# EasyEDA schematic Schematic.json
TITLE: New Schematic; REV: 1.0; Date: 2018-01-26; Sheet: 1/1; Drawn By: ridvanaltun
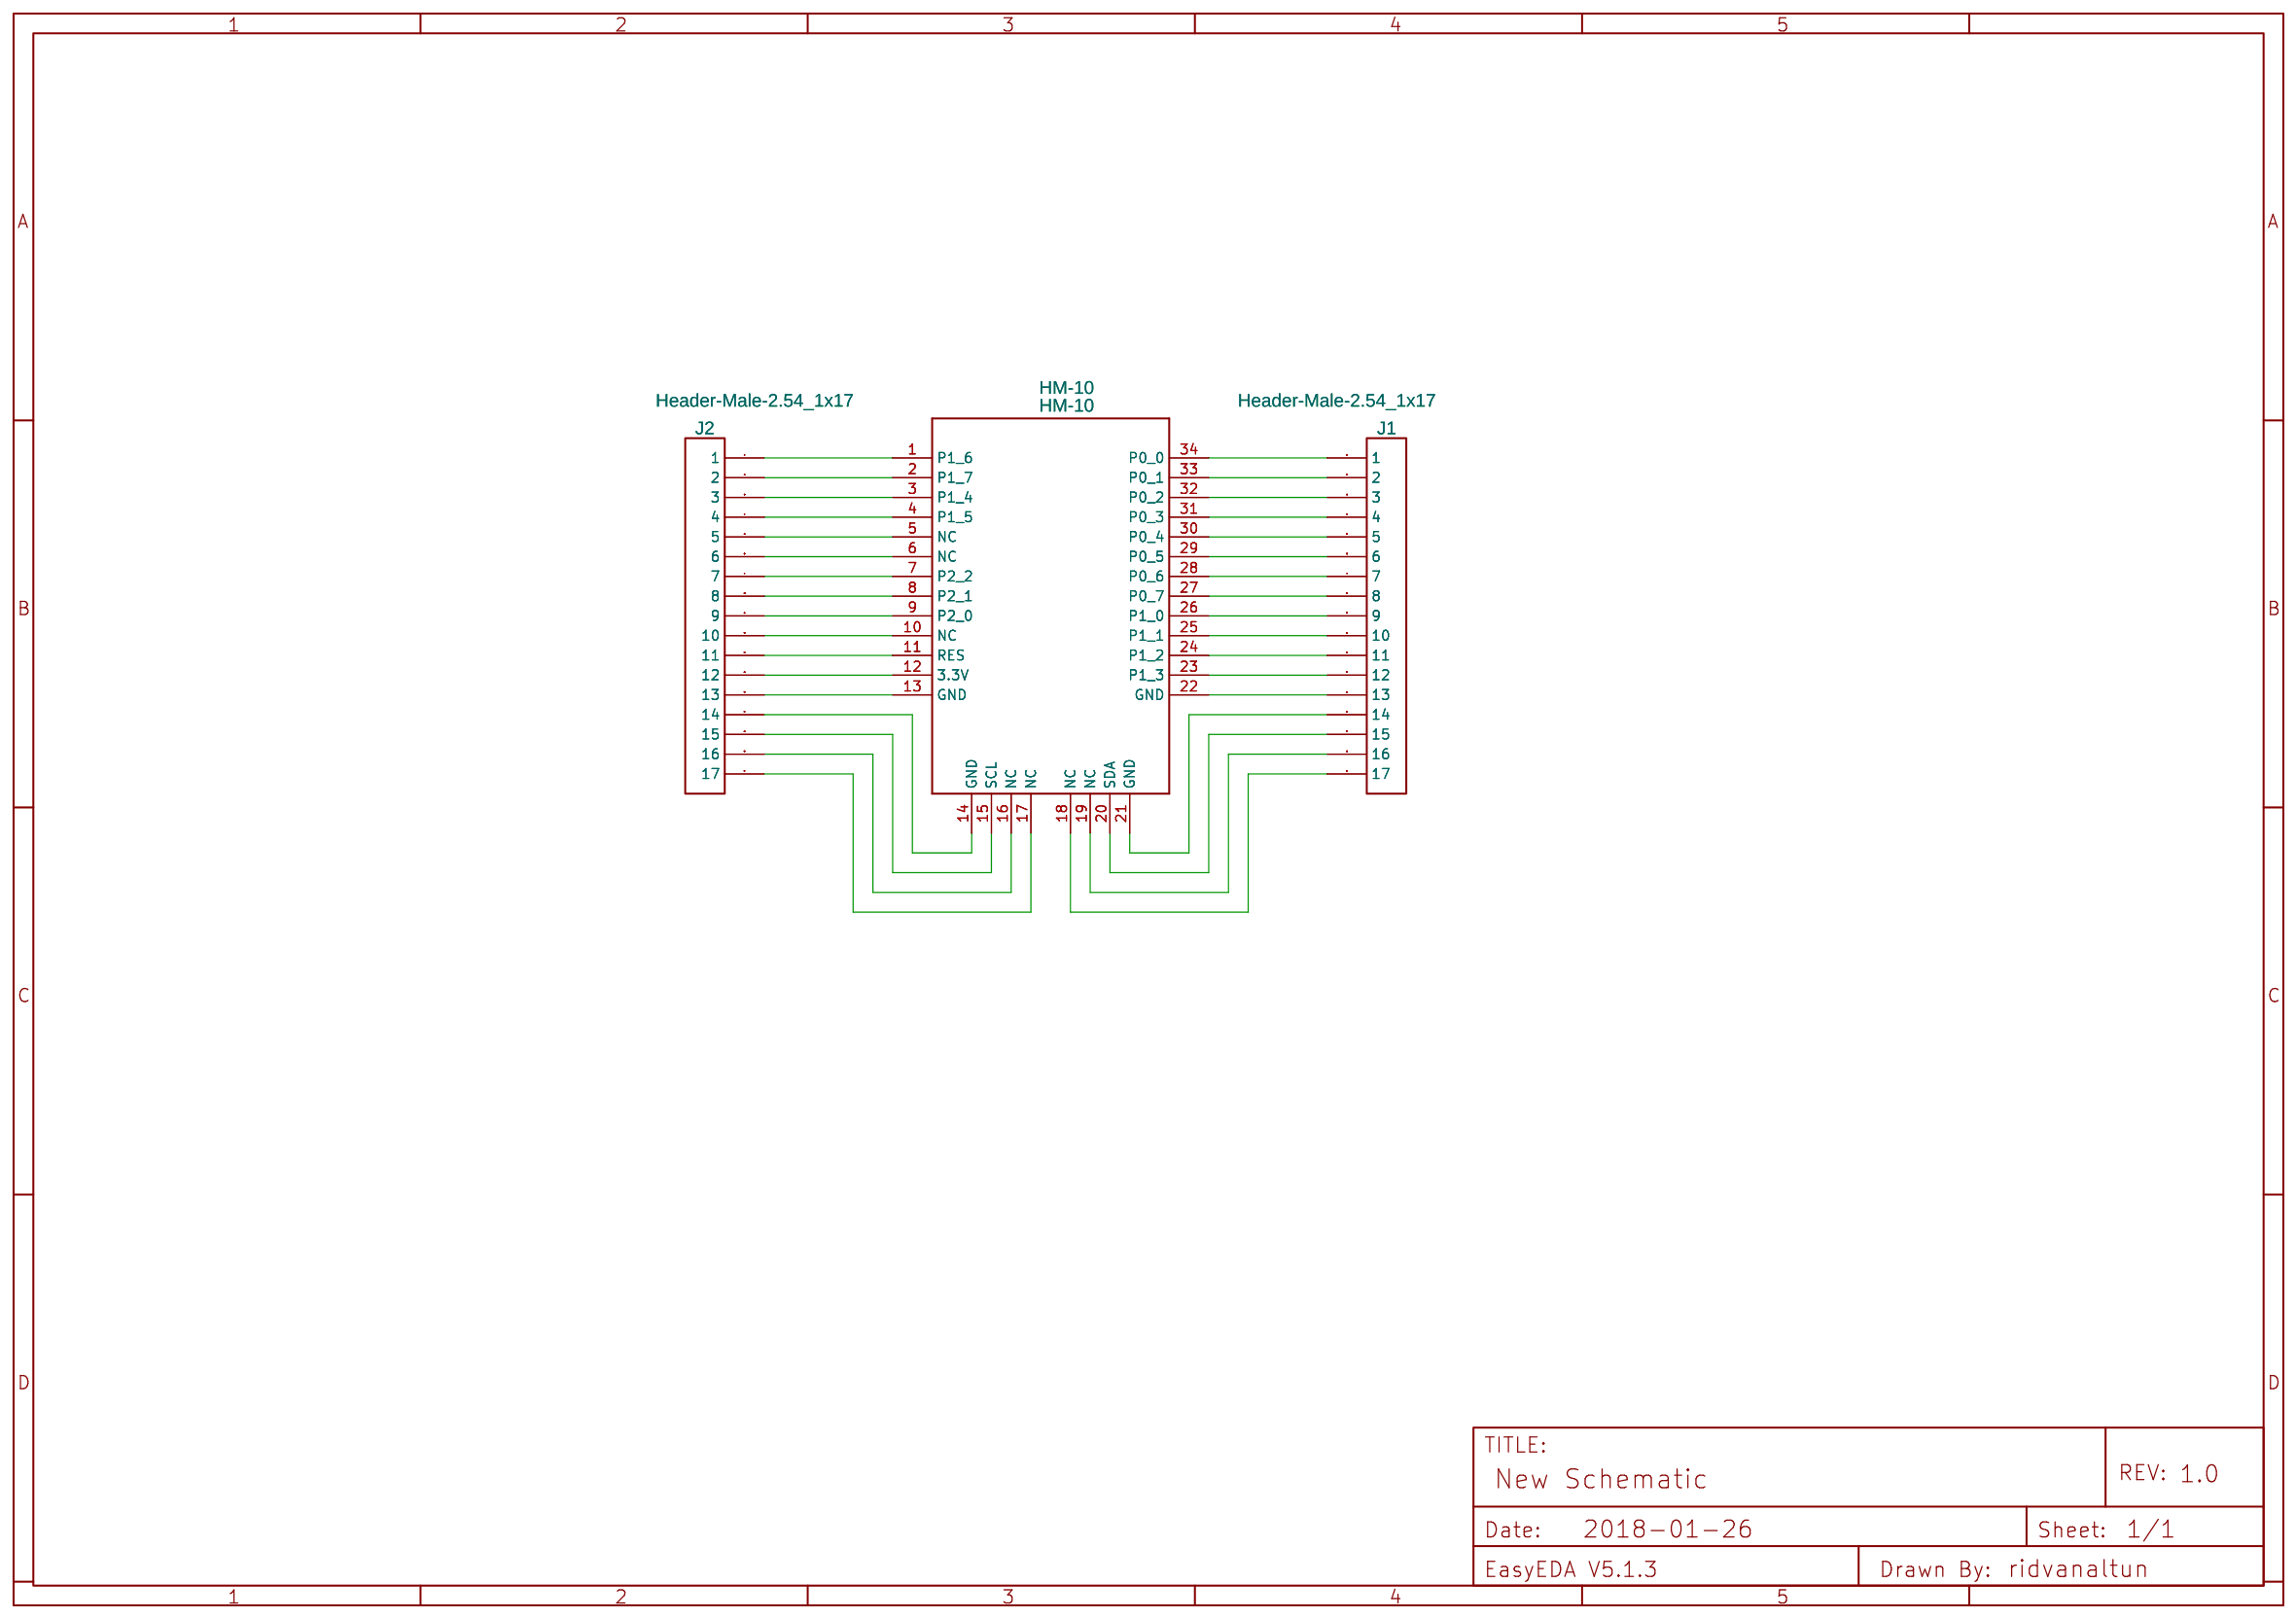
[diagram p0: schematic sheet]

## Parts
HM-10  HM-10  [HM-10]
J1  Header-Male-2.54_1x17  [17X1/2.54 PIN HEADER]
J2  Header-Male-2.54_1x17  [17X1/2.54 PIN HEADER]

## Library data of the parts
HM-10 = -: Manufacturer Part: ?
J1 J2 = -: Manufacturer: BOOMELE; Manufacturer Part: 2.54mm 1*17PHeader; LCSC: C50981; image: http://image.lceda.cn/szlcsc/C50981.jpg; Contributor: MARCHELLLOS

## Nets
Net-(HM-10-1): HM-10.1(P1_6) J2.1
Net-(HM-10-2): HM-10.2(P1_7) J2.2
Net-(HM-10-3): HM-10.3(P1_4) J2.3
Net-(HM-10-4): HM-10.4(P1_5) J2.4
Net-(HM-10-5): HM-10.5(NC) J2.5
Net-(HM-10-6): HM-10.6(NC) J2.6
Net-(HM-10-7): HM-10.7(P2_2) J2.7
Net-(HM-10-8): HM-10.8(P2_1) J2.8
Net-(HM-10-9): HM-10.9(P2_0) J2.9
Net-(HM-10-10): HM-10.10(NC) J2.10
Net-(HM-10-11): HM-10.11(RES) J2.11
Net-(HM-10-12): HM-10.12(3.3V) J2.12
Net-(HM-10-13): HM-10.13(GND) J2.13
Net-(HM-10-14): HM-10.14(GND) J2.14
Net-(HM-10-15): HM-10.15(SCL) J2.15
Net-(HM-10-16): HM-10.16(NC) J2.16
Net-(HM-10-17): HM-10.17(NC) J2.17
Net-(HM-10-18): HM-10.18(NC) J1.17
Net-(HM-10-19): HM-10.19(NC) J1.16
Net-(HM-10-20): HM-10.20(SDA) J1.15
Net-(HM-10-21): HM-10.21(GND) J1.14
Net-(HM-10-22): HM-10.22(GND) J1.13
Net-(HM-10-23): HM-10.23(P1_3) J1.12
Net-(HM-10-24): HM-10.24(P1_2) J1.11
Net-(HM-10-25): HM-10.25(P1_1) J1.10
Net-(HM-10-26): HM-10.26(P1_0) J1.9
Net-(HM-10-27): HM-10.27(P0_7) J1.8
Net-(HM-10-28): HM-10.28(P0_6) J1.7
Net-(HM-10-29): HM-10.29(P0_5) J1.6
Net-(HM-10-30): HM-10.30(P0_4) J1.5
Net-(HM-10-31): HM-10.31(P0_3) J1.4
Net-(HM-10-32): HM-10.32(P0_2) J1.3
Net-(HM-10-33): HM-10.33(P0_1) J1.2
Net-(HM-10-34): HM-10.34(P0_0) J1.1
